# EAGLE design LMP9100_breakout (EAGLE 7.7.0)
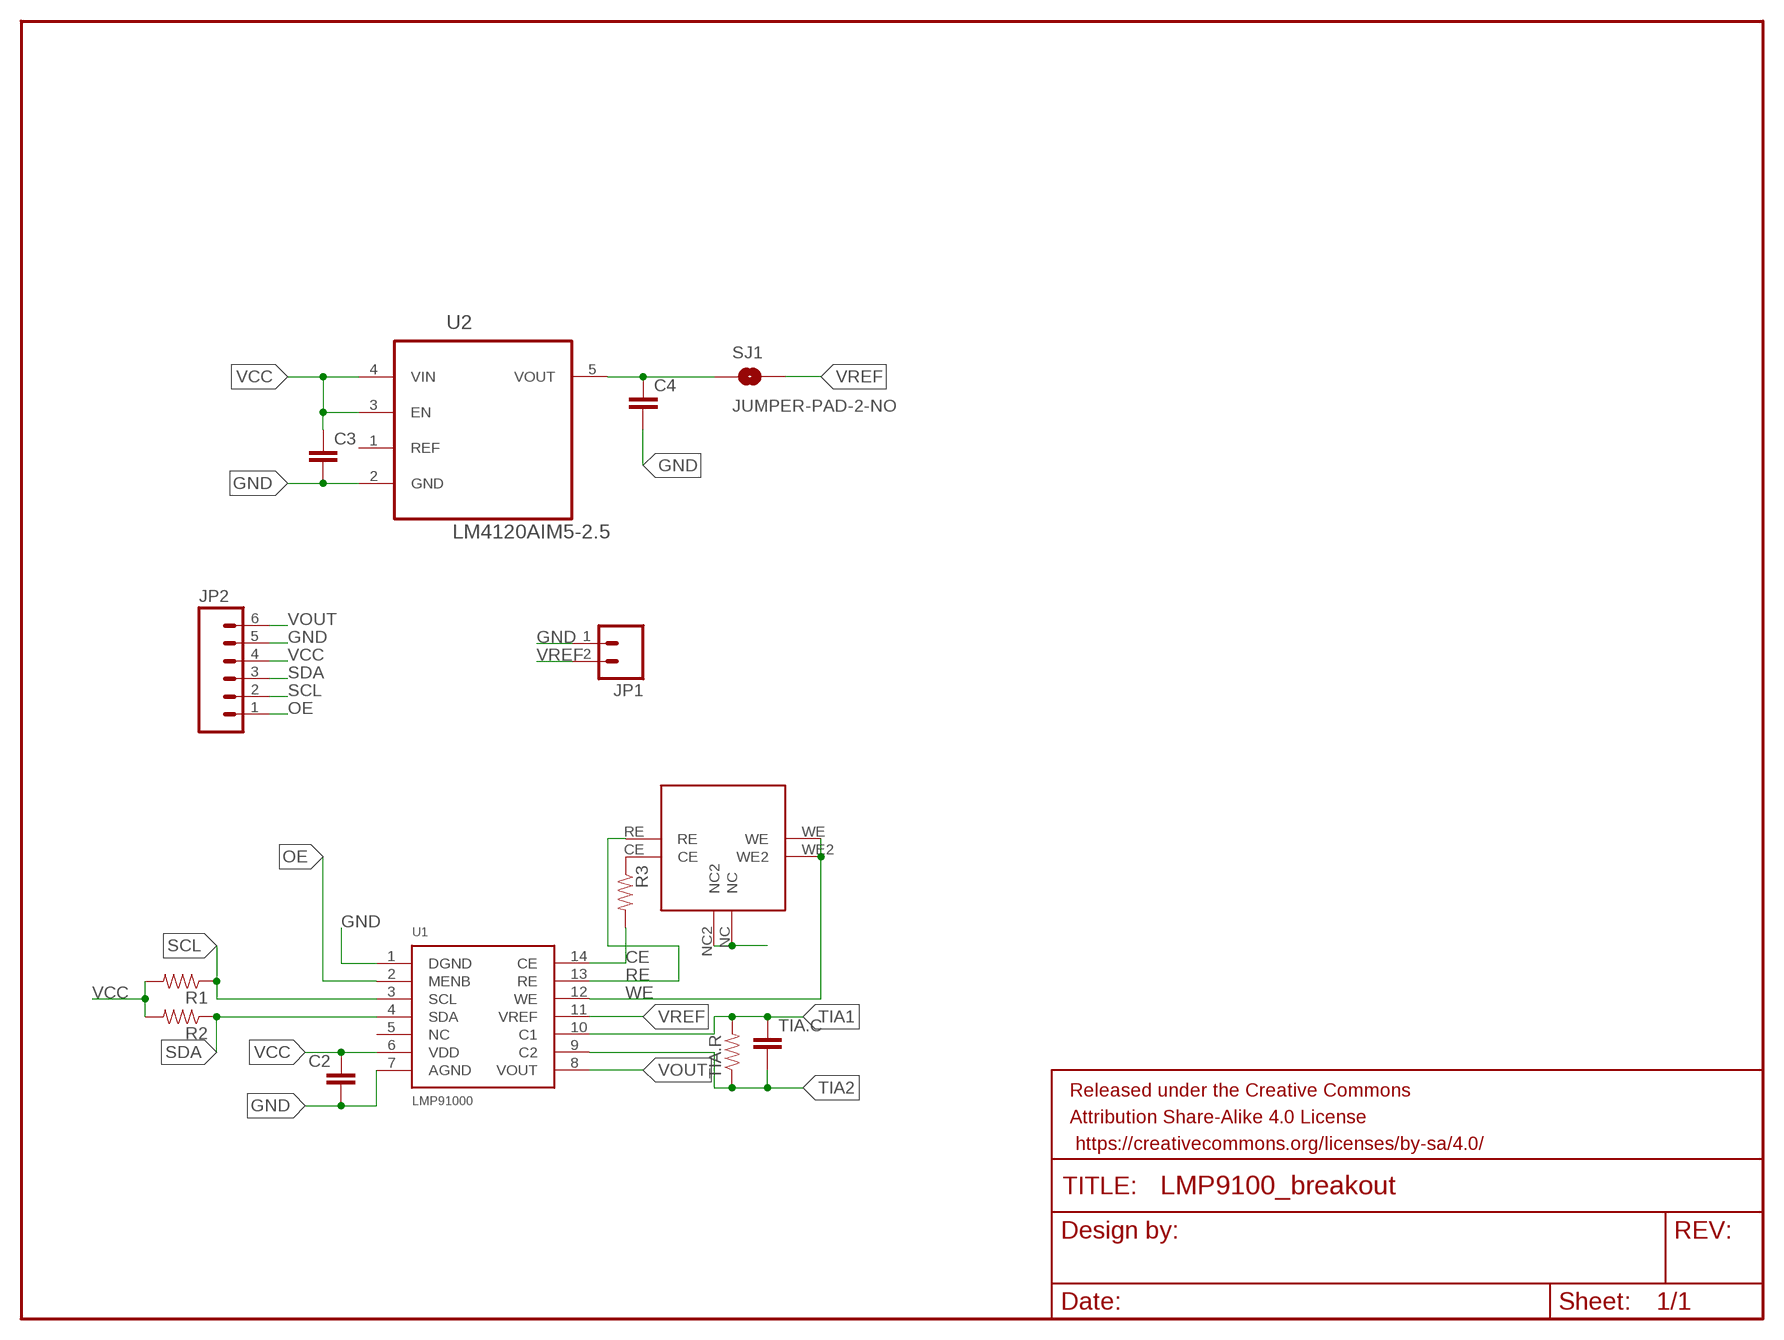
[diagram p0: schematic, sheet 1]

## Parts
C2  CAP0603-CAP  [0603-CAP]
C3  CAP0603-CAP  [0603-CAP]
C4  CAP0603-CAP  [0603-CAP]
FRAME1  FRAME-LETTER  [CREATIVE_COMMONS]
JP1  M02PTH  [1X02]
JP2  M06SILK_FEMALE_PTH  [1X06]
R1  RESISTOR0603-RES  [0603-RES]
R2  RESISTOR0603-RES  [0603-RES]
R3  RESISTOR0603-RES  [0603-RES]
SJ1  JUMPER-PAD-2-NO  [PAD-JUMPER-2-NO_NO_SILK]
TIA.C  CAP0603-CAP  [0603-CAP]
TIA.R  RESISTOR0603-RES  [0603-RES]
U1  LMP91000  [LMP91000]
U2  LM4120AIM5-2.5  [SOT95P284X122-5N]
U$1  SPEC-SENSOR  [SPEC-SENSOR]

## Nets
CE: R3.2 U1.14(CE)
GND: C2.2 C3.2 C4.2 JP1.1 JP2.5 U1.1(DGND) U1.7(AGND) U2.2(GND) U$1.NC U$1.NC2
N$1: R3.1 U$1.CE
N$3: C4.1 SJ1.1 U2.5(VOUT)
OE: JP2.1 U1.2(MENB)
RE: U1.13(RE) U$1.RE
SCL: JP2.2 R1.1 U1.3(SCL)
SDA: JP2.3 R2.1 U1.4(SDA)
TIA1: TIA.C.1 TIA.R.2 U1.10(C1)
TIA2: TIA.C.2 TIA.R.1 U1.9(C2)
VCC: C2.1 C3.1 JP2.4 R1.2 R2.2 U1.6(VDD) U2.3(EN) U2.4(VIN)
VOUT: JP2.6 U1.8(VOUT)
VREF: JP1.2 SJ1.2 U1.11(VREF)
WE: U1.12(WE) U$1.WE U$1.WE2
Unconnected: U1.5(NC) U2.1(REF)

## Library data of the parts
C2-C4 TIA.C = SparkFun-Passives:CAP: Capacitor Standard 0603 ceramic capacitor, and 0.1" leaded capacitor.
FRAME1 = SparkFun-Aesthetics:FRAME-LETTER: Schematic Frame Standard 8.5x11 US Letter frame
JP1 = SparkFun-Connectors:M02: Standard 2-pin 0.1" header. Use with - straight break away headers ( PRT-00116) - right angle break away headers (PRT-00553) - swiss pins (PRT-00743) - machine pins (PRT-00117) - female headers (PRT-00115) Molex polarized connector foot print use with: PRT-08233 with associated crimp pins and housings. 2.54_SCREWTERM for use with PRT-10571. 3.5mm Screw Terminal footprints for PRT-08084 5mm Screw Terminal footprints for use with PRT-08432
JP2 = SparkFun-Connectors:M06: Header 6 Standard 6-pin 0.1" header. Use with straight break away headers (SKU : PRT-00116), right angle break away headers (PRT-00553), swiss pins (PRT-00743), machine pins (PRT-00117), and female headers (PRT-00115). Molex polarized connector foot print use with SKU : PRT-08094 with associated crimp pins and housings. NOTES ON THE VARIANTS LOCK and LOCK_LONGPADS... This footprint was designed to help hold the alignment of a through-hole component (i.e. 6-pin header) while soldering it into place. You may notice that each hole has been shifted either up or down by 0.005 of an inch from it's more standard position (which is a perfectly straight line). This slight alteration caused the pins (the squares in the middle) to touch the edges of the holes. Because they are alternating, it causes a "brace" to hold the component in place. 0.005 has proven to be the perfect amount of "off-center" position when using our standard breakaway headers. Although looks a little odd when you look at the bare footprint, once you have a header in there, the alteration is very hard to notice. Also,if you push a header all the way into place, it is covered up entirely on the bottom side. This idea of altering the position of holes to aid alignment will be further integrated into the Sparkfun Library for other footprints. It can help hold any component with 3 or more connection pins.; PROD_ID: CONN-08437
R1-R3 TIA.R = SparkFun-Passives:RESISTOR: Resistor Basic schematic elements and footprints for 0603, 1206, and PTH resistors.
SJ1 = SparkFun-Passives:JUMPER-PAD-2-NO
U1 = lmp91000:LMP91000
U2 = LM4120AIM5-2.5:LM4120AIM5-2.5: Dropout voltage reference; AVAILABILITY: Good; DESCRIPTION: Precision Micropower Low Dropout Voltage Reference 5-SOT-23 -40 to 85; MF: Texas Instruments; MP: LM4120AIM5-2.5/NOPB; PACKAGE: SOT-23 Texas Instruments; PRICE: 1.40 USD
U$1 = lmp91000:SPEC-SENSOR

## Board
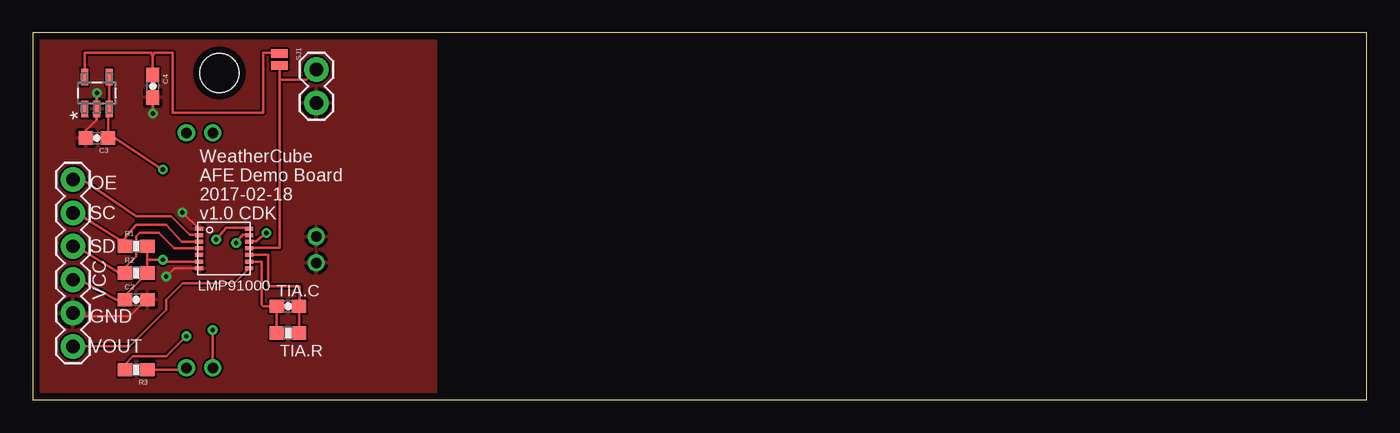
[diagram p1: board, top side]
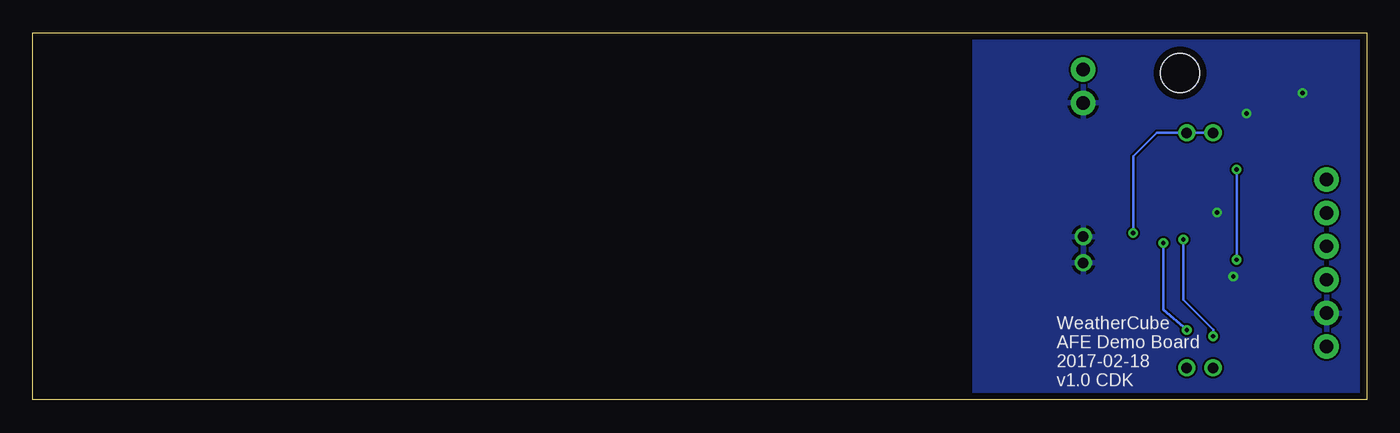
[diagram p2: board, bottom side, seen from below]

Size 101.6 x 27.94 mm. Coordinates in mm from the lower left corner, seen from the top.
Outline: 101.6,27.94 0,27.94 0,0 101.6,0 101.6,27.94
Copper layers (1*16): Top 0.035mm / dielectric 1.5mm / Bottom 0.035mm
Design rules "default *": minimum track width 10mil, minimum drill 24mil, track to track 6mil, track to pad 8mil, pad to pad 8mil, via to via 8mil, smd to smd 8mil, copper to edge 20mil, drill to drill 8mil, minimum pad ring 10mil, minimum via ring 8mil, stop-mask expansion 4mil, vias tented up to drill 13mil, thermal gap 10mil
Holes 3 mm at 14.22,24.89

### Footprints (pad centres in the part's own frame; a part is rotated, then mirrored left to right if it is on the bottom)
0603-CAP = smd 1.1 x 1: 1 -0.85,0; 2 0.85,0
1X02 = drill 1.016 pad 1.88: 1 0,0; 2 2.54,0
1X06 = drill 1.016 pad 1.88: 1 0,0; 2 2.54,0; 3 5.08,0; 4 7.62,0; 5 10.16,0; 6 12.7,0
0603-RES = smd 1.1 x 1: 1 -0.85,0; 2 0.85,0
PAD-JUMPER-2-NO_NO_SILK = smd 0.635 x 1.27: 1 -0.45,0; 2 0.45,0
LMP91000 = smd 0.61 x 0.305: 1 0.1,3.5; 2 0.1,3; 3 0.1,2.5; 4 0.1,2; 5 0.1,1.5; 6 0.1,1; 7 0.1,0.5; 8 3.9,0.5; 9 3.9,1; 10 3.9,1.5; 11 3.9,2; 12 3.9,2.5; 13 3.9,3; 14 3.9,3.5
SOT95P284X122-5N = smd 1.27 x 0.533: 1 -1.219,0.94; 2 -1.219,0; 3 -1.219,-0.94; 4 1.219,-0.94; 5 1.219,0.94
SPEC-SENSOR = drill 0.8: CE 17.89,-1; NC 7.89,8.89; NC2 9.89,8.89; RE 17.89,1; WE 0,-1; WE2 0,1

### Placement (x,y rotation side)
C2  7.87,7.62 0 top
C3  4.88,19.93 180 top
C4  9.14,23.88 270 top
FRAME1  19.05,-16.51 0 top  (outside the outline)
JP1  21.59,22.61 90 top
JP2  3.05,16.76 270 top
R1  7.87,11.68 0 top
R2  7.87,9.65 0 top
R3  7.87,2.29 180 top
SJ1  18.79,25.91 270 top
TIA.C  19.43,7.11 180 top
TIA.R  19.43,5.08 0 top
U1  12.57,9.53 0 top
U2  4.88,23.36 90 top
U$1  12.7,20.32 270 top

### Tracks (layer width: path | path; a pad name or v marks a point on that pad's centre or on a via)
CE  (via drill 0.33)
  Top 0.203: v13.97,12.19 14.73,13.08 16.4,13.08 U1.14 | R3.2 7.02,2.71 7.62,3.3 10.16,3.3 v11.7,4.84
  Bottom 0.203: v13.97,12.19 13.97,7.62 11.7,5.35 v11.7,4.84
GND  (via drill 0.33)
  Top 0.203: v4.88,23.36 U2.2 4.88,21.33 4.03,20.48 4.06,20.45 4.06,19.81 4.03,19.84 C3.2 | C4.2 v9.14,21.79 | U1.7 10.79,10.03 v10.16,9.4 | U1.1 v11.4,14.25 | C2.2 8.72,7.71 | 8.72,7.96 8.72,7.71 | 8.72,7.71 7.37,6.35 3.56,6.35 JP2.5
  pour Bottom: -3.05,-2.78 -3.05,28.07 29.85,28.3 29.85,-2.54
  pour Top: -3.05,30.48 30.73,30.48 30.73,-5.08 -3.05,-5.08
N$1
  Top 0.203: R3.1 11.56,2.29 U$1.CE
N$3
  Top 0.203: U2.5 3.94,26.42 9.02,26.42 9.14,26.16 | SJ1.1 18.8,26.42 17.53,26.42 17.53,21.84 10.67,21.84 10.67,26.42 9.23,26.42 9.14,26.16 | 9.14,26.16 C4.1
OE
  Top 0.203: U1.2 12.59,12.57 11.94,12.57 10.54,13.97 7.87,13.97 3.81,16.76 JP2.1
RE  (via drill 0.33)
  Top 0.203: U$1.RE v13.7,5.32 | v15.49,11.94 16,12.57 16.39,12.57 U1.13
  Bottom 0.203: v13.7,5.32 15.49,6.86 v15.49,11.94
SCL
  Top 0.203: U1.3 11.34,12.03 10.16,13.34 7.87,13.34 7.02,12.36 7.02,12.19 | R1.1 7.02,12.19 | JP2.2 3.3,14.22 6.6,12.19 7.02,12.19
SDA
  Top 0.203: U1.4 10.76,11.53 9.59,12.7 8.13,12.7 7.87,12.45 7.87,10.92 7.02,10.07 R2.1 6.6,9.65 3.3,11.68 JP2.3
TIA1
  Top 0.203: TIA.R.2 TIA.C.1 20.32,7.02 20.32,8.64 18.03,8.64 17.93,8.74 17.93,11.03 U1.10
TIA2
  Top 0.203: TIA.C.2 TIA.R.1 | U1.9 17.41,10.53 17.41,7.22 17.53,7.11 TIA.C.2 | 18.54,7.02 TIA.C.2
VCC  (via drill 0.33)
  Top 0.203: R1.2 8.72,10.67 | 8.72,10.67 R2.2 | R2.2 8.78,9.4 | U2.4 U2.3 5.73,22.05 C3.1 6.28,19.93 v9.91,17.53 | 8.72,10.67 v9.91,10.67 10.05,10.53 U1.6 | R2.2 7.02,7.95 C2.1 6.35,7.62 3.56,9.14 JP2.4
  Bottom 0.203: v9.91,17.53 v9.91,10.67
VOUT
  Top 0.203: U1.8 15.34,8.89 11.43,8.89 10.16,7.62 10.16,6.86 7.37,4.06 JP2.6
VREF
  Top 0.203: SJ1.2 18.8,24.38 | 18.8,24.38 18.8,11.56 16.57,11.56 U1.11 | JP1.2 20.83,24.38 18.8,24.38
WE  (via drill 0.33)
  Top 0.203: v17.78,12.7 17.02,12.06 16.56,12.06 U1.12
  Bottom 0.203: U$1.WE U$1.WE2 16,20.32 17.78,18.54 v17.78,12.7

### Text on the board
tNames: OE | SC | WeatherCube / AFE Demo Board / 2017-02-18 / v1.0 CDK | SD | VCC | GND | VOUT
bNames: WeatherCube / AFE Demo Board / 2017-02-18 / v1.0 CDK